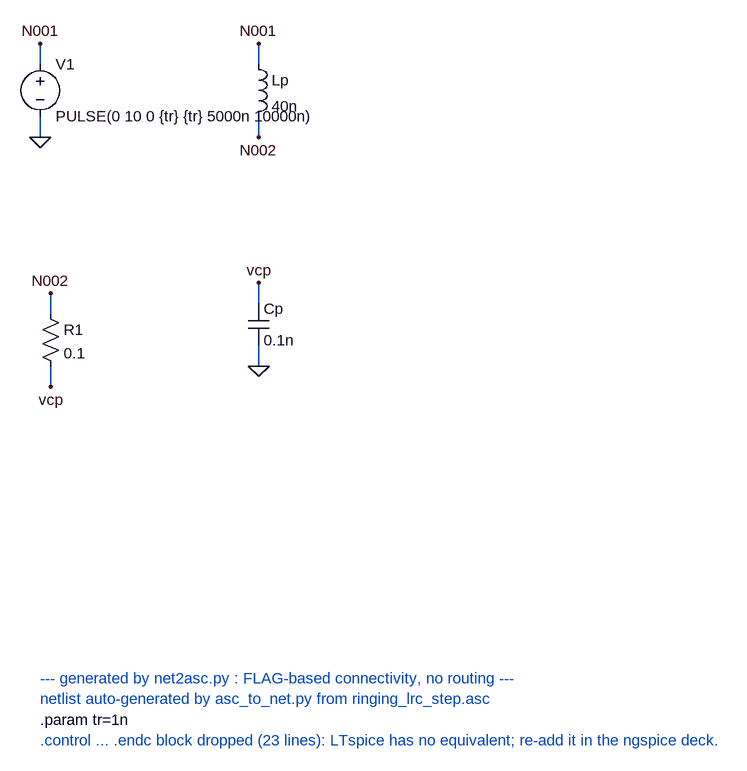
[diagram p0: schematic ringing_lrc_step.asc]
ringing_lrc_step.asc, the LTspice schematic file:
Version 4
SHEET 1 880 1256
WIRE 0 16 0 -16
WIRE 0 96 0 128
WIRE 336 16 336 -16
WIRE 336 96 336 128
WIRE 16 400 16 368
WIRE 16 480 16 512
WIRE 336 384 336 352
WIRE 336 448 336 480
FLAG 0 -16 N001
FLAG 0 128 0
FLAG 336 -16 N001
FLAG 336 128 N002
FLAG 16 368 N002
FLAG 16 512 vcp
FLAG 336 352 vcp
FLAG 336 480 0
SYMBOL voltage 0 0 R0
SYMATTR InstName V1
SYMATTR Value PULSE(0 10 0 {tr} {tr} 5000n 10000n)
SYMBOL ind 320 0 R0
SYMATTR InstName Lp
SYMATTR Value 40n
SYMBOL res 0 384 R0
SYMATTR InstName R1
SYMATTR Value 0.1
SYMBOL cap 320 384 R0
SYMATTR InstName Cp
SYMATTR Value 0.1n
TEXT 0 960 Left 2 ;--- generated by net2asc.py : FLAG-based connectivity, no routing ---
TEXT 0 992 Left 2 ;netlist auto-generated by asc_to_net.py from ringing_lrc_step.asc
TEXT 0 1024 Left 2 !.param tr=1n
TEXT 0 1056 Left 2 ;.control ... .endc block dropped (23 lines): LTspice has no equivalent; re-add it in the ngspice deck.

The netlist it stands for:
* ringing_lrc_step.asc
V1 N001 0 PULSE(0 10 0 {tr} {tr} 5000n 10000n)
Lp N001 N002 40n
R1 N002 vcp 0.1
Cp vcp 0 0.1n
* --- generated by net2asc.py : FLAG-based connectivity, no routing ---
* netlist auto-generated by asc_to_net.py from ringing_lrc_step.asc
.param tr=1n
* .control ... .endc block dropped (23 lines): LTspice has no equivalent; re-add it in the ngspice deck.
.backanno
.end